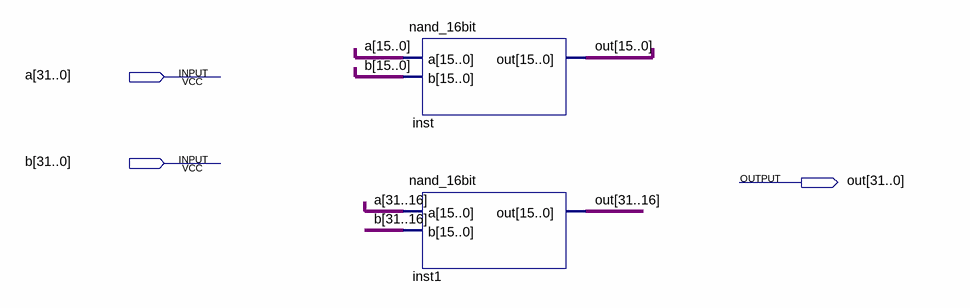
[diagram p0: schematic sheet]
// Quartus schematic nand_32bit.bdf as structural Verilog: 2 symbols, 3 pins
module nand_32bit (
  input  [31:0] a,
  input  [31:0] b,
  output [31:0] out
);

  nand_16bit inst (.a(a[15:0]), .b(b[15:0]), .out(out[15:0]));
  nand_16bit inst1 (.a(a[31:16]), .b(b[31:16]), .out(out[31:16]));
endmodule
